# Altium schematic sheet interface.SchDoc
size A4
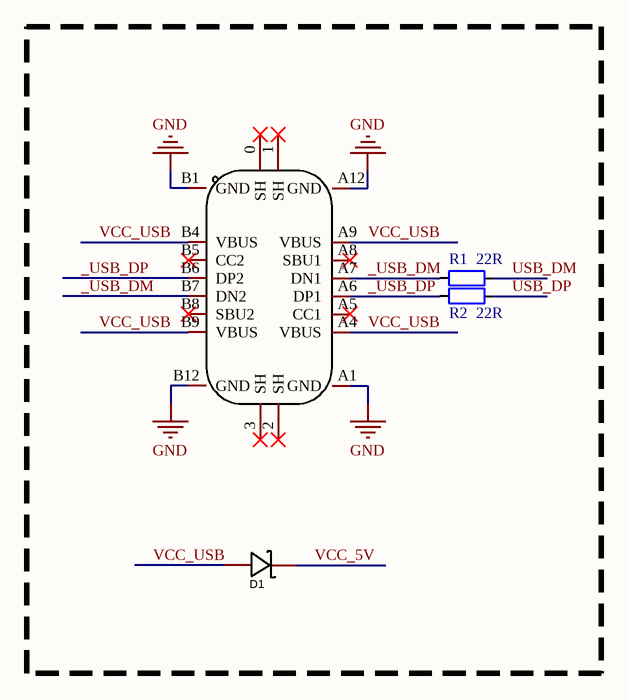
[diagram p0: interface.SchDoc]

## Parts
D1  B5819WS  [SOD-323_L1.8-W1.3-LS2.5-RD]  (value not drawn)
R1  22R  [R0603]
R2  22R  [R0603]
USBC1  TYPE-C-31-M-12  [Type-C-TOP]  (value not drawn)

## Nets
GND: USBC1.A1(GND) USBC1.A12(GND) USBC1.B1(GND) USBC1.B12(GND)
_USB_DM: R1.1 USBC1.A7(DN1) USBC1.B7(DN2)
_USB_DP: R2.1 USBC1.A6(DP1) USBC1.B6(DP2)
USB_DM: R1.2
USB_DP: R2.2
VCC_5V: D1.1(K)
VCC_USB: D1.2(A) USBC1.A4(VBUS) USBC1.A9(VBUS) USBC1.B4(VBUS) USBC1.B9(VBUS)

Not connected (* = marked no-connect by the designer): USBC1 0(SH)* 1(SH)* 2(SH)* 3(SH)* A5(CC1)* A8(SBU1)* B5(CC2)* B8(SBU2)*

## Library data of the parts
D1 = B5819WS: Manufacturer: CJ(江苏长电/长晶); Symbol: B5819WS_C22624; Add into BOM: yes; Reverse Voltage (Vr): 40V; Average Rectified Current (Io): 1A; Forward Voltage (Vf@If): 600mV@1A; Name: B5819WS; Device: B5819WS_C22624; LCSC Part Name: 40V 1A 600mV@1A; Supplier Part: C22624; Manufacturer Part: B5819WS; Supplier Footprint: SOD-323; JLCPCB Part Class: Extended Part; Datasheet: https://atta.szlcsc.com/upload/public/pdf/source/20170919/C22624_1505799673448977596.pdf; Supplier: LCSC; Convert to PCB: yes
R1 R2 = R0603
USBC1 = TYPE-C-31-M-12: Manufacturer: 韩国韩荣; Add into BOM: yes; Connector Type: Type-C; Gender: 母座; Number of Contacts: 16; Number of Ports: 1; Current Rating - Power (Max): 5A; Name: TYPE-C-31-M-12; Symbol: TYPE-C-31-M-12; Device: TYPE-C-31-M-12; LCSC Part Name: Type-C 母座; Supplier Part: C165948; Manufacturer Part: TYPE-C-31-M-12; Supplier Footprint: SMD; JLCPCB Part Class: Extended Part; Datasheet: https://atta.szlcsc.com/upload/public/pdf/source/20220525/466408E853115E789EDB0DDC29077C05.pdf; Supplier: LCSC; Convert to PCB: yes; Standard: -; Mounting Style: -; Contact Material: -; Contact Plating: -; Operating Temperature Range: -; Welding Temperature (Max): -